# EasyEDA Pro project Universal Transceiver.epro

# Schematic Schematic
Board Name: Universal Receiver; Create Date: 2025-03-07; Page Name: Schematic; Project Name: Universal Receiver; Schematic Name: Schematic; Update Date: 2025-03-12; Add into BOM: yes; Company: MUS; Convert to PCB: yes; Date: 2025-03-07; REV: 1.0; Sheet: 1/1
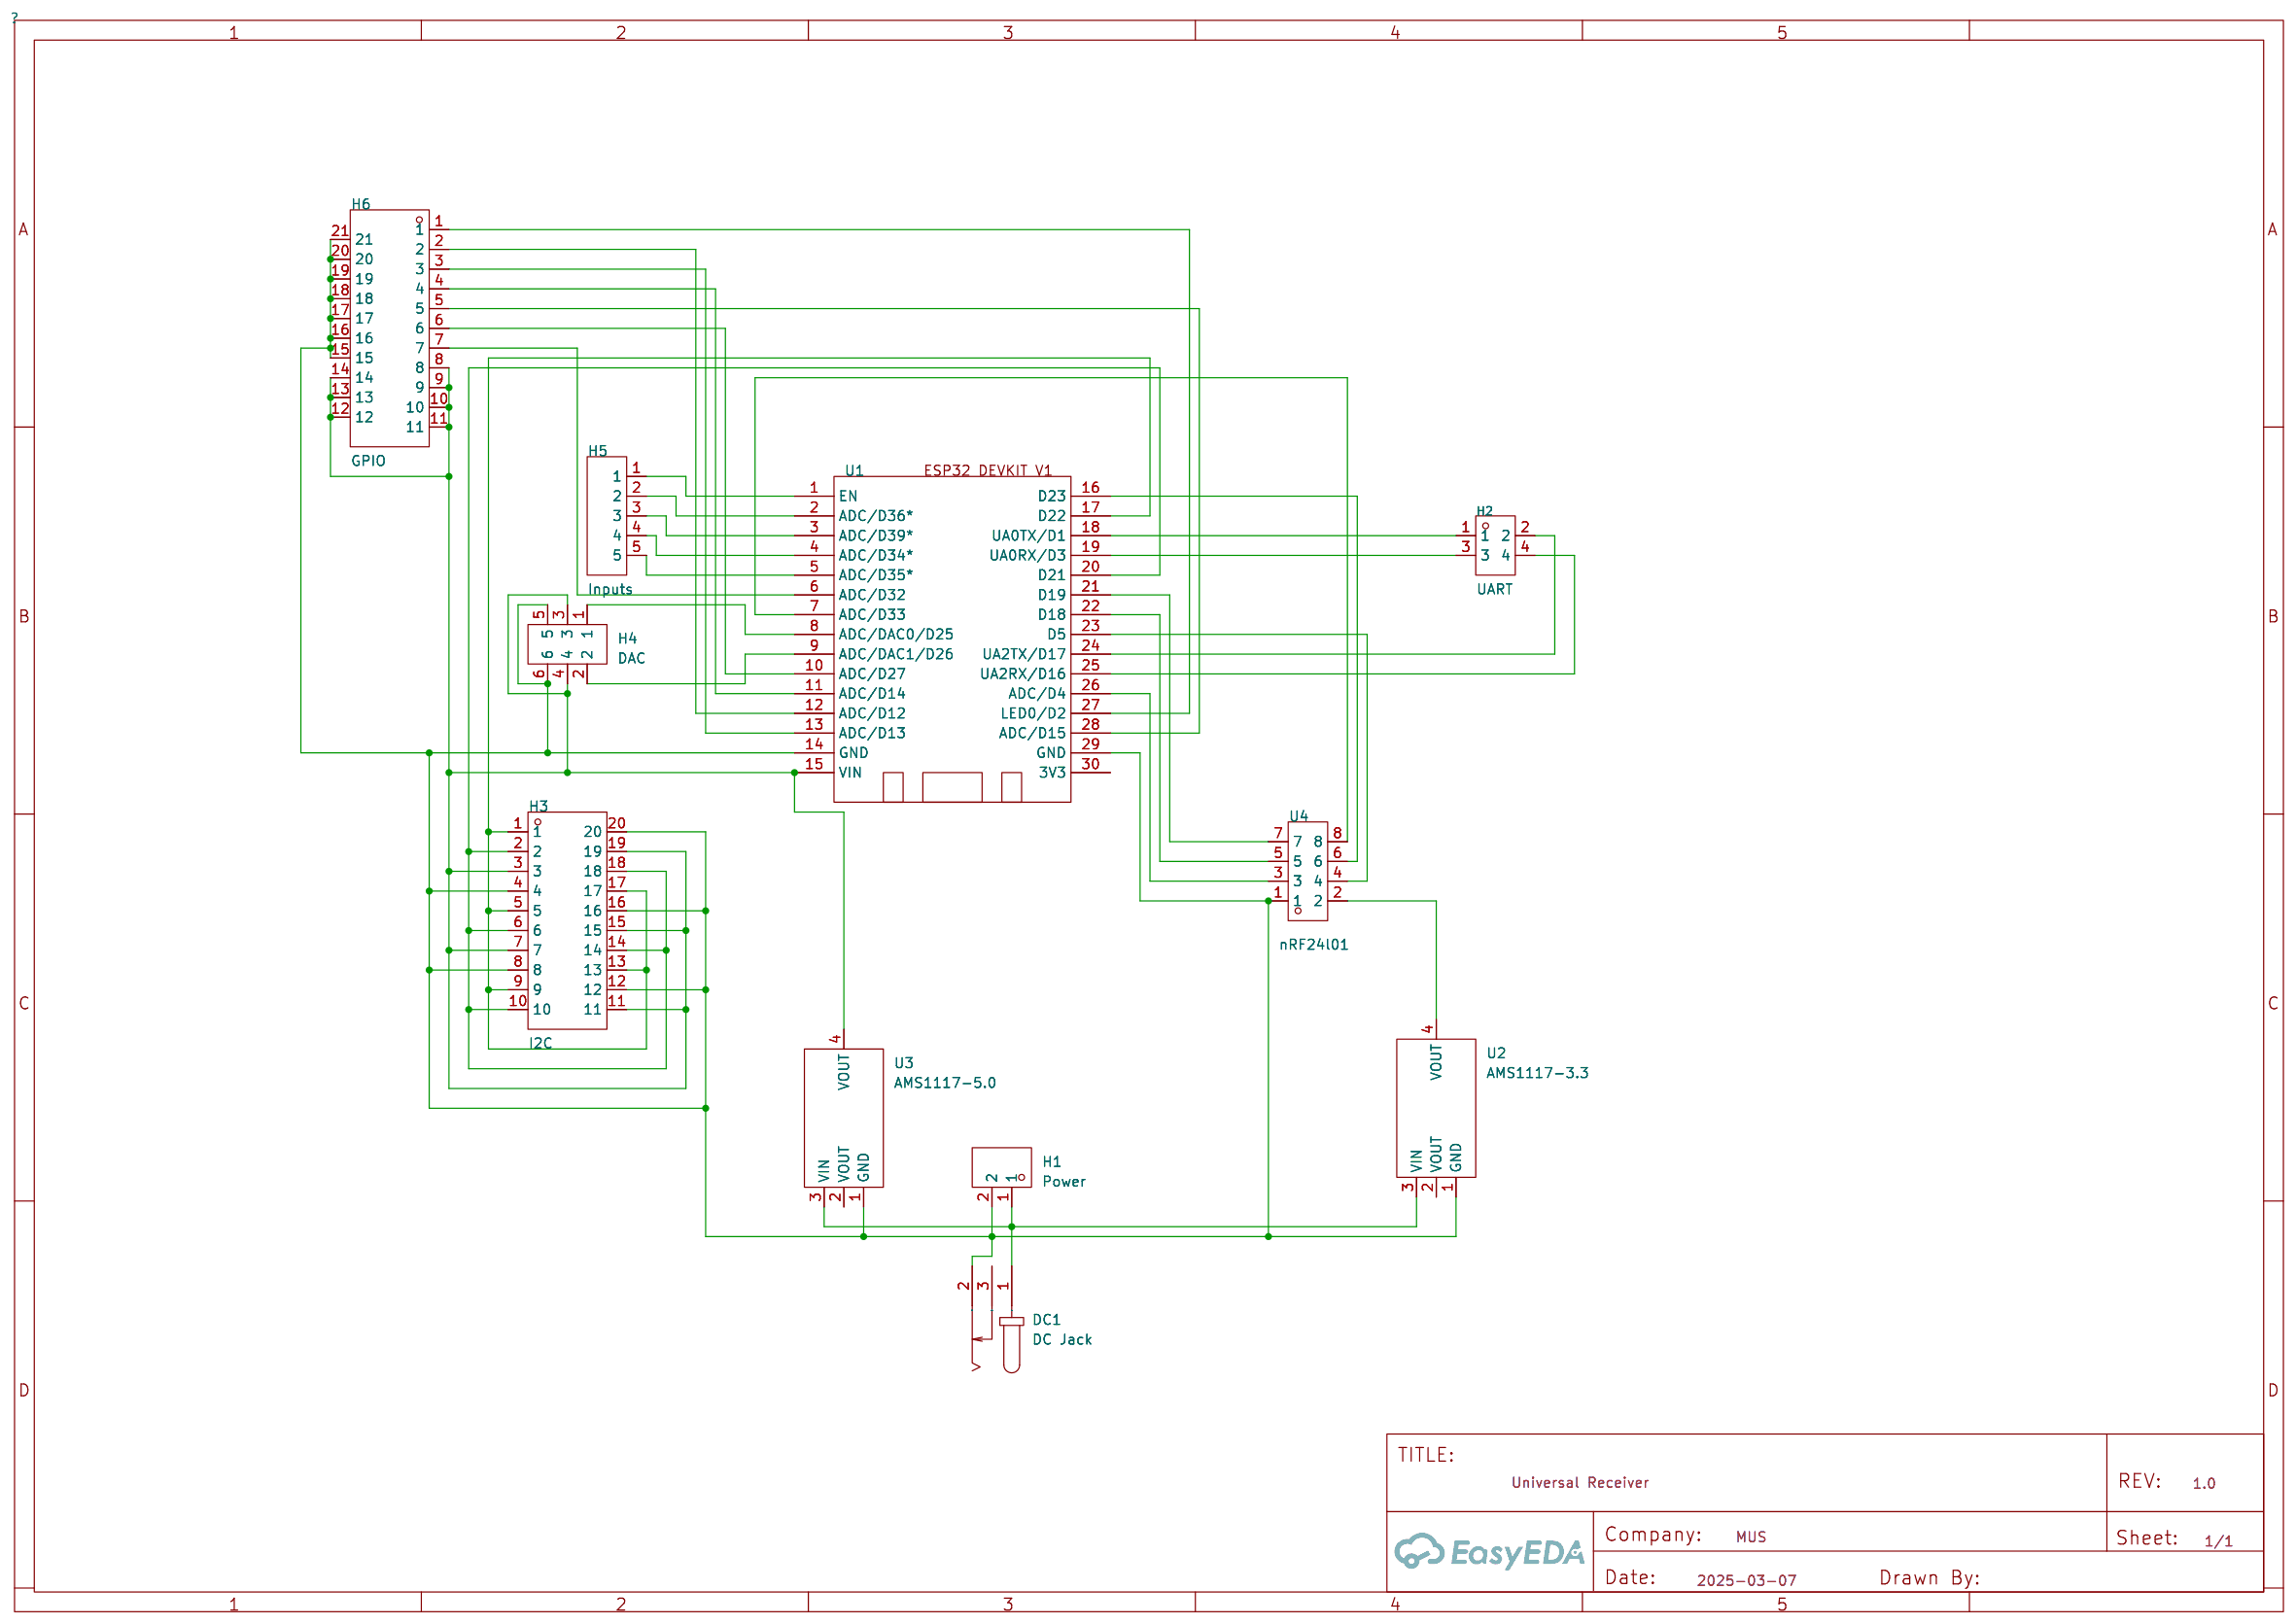
[diagram p0: schematic sheet]

## Parts
DC1  DC Jack  [DC-IN-TH_DC-005-5A-2.0]
H1  Power  [HDR-TH_2P-P2.54-V-M_5]
H2  UART  [HDR-TH_4P-P2.54-V-M-R2-C2-S2.54]
H3  I2C  [HDR-TH_20P-P2.54-V-M-R4-C5-S2.54]
H4  DAC  [HDR-TH_6P-P2.54-V-M-R2-C3-S2.54]
H5  Inputs  [HDR-TH_5P-P2.54-V-M]
H6  GPIO  [CONN-TH_HX-PZ2.54-3X7P-ZZ]
U1  -  [ESP32 Devkit V1]
U2  AMS1117-3.3  [SOT-223-3_L6.5-W3.4-P2.30-LS7.0-BR]
U3  AMS1117-5.0  [SOT-223_L6.5-W3.5-P2.30-LS7.0-BR]
U4  nRF24l01  [HDR-TH_8P-P2.54-V-F-R2-C4-S2.54]

## Library data of the parts
DC1 = DC-005-5A-2.0: Connector Type:DC Power Receptacle Mounting Style:Bend insert Inside Contact Diameter:2mm Outside Contact Diameter:6.2mm Current Rating (Max):5A Voltage Rating (Max):24V Operating Temperature Range:-20℃~+70℃ Operating Temperature Range:-20℃~+70℃; LCSC Part Name: DC电源插座 内径:2mm 外径:6.2mm; Supplier Part: C381116; Manufacturer: XKB Connection(中国星坤); Supplier Footprint: 插件; JLCPCB Part Class: Extended Part; Datasheet: https://atta.szlcsc.com/upload/public/pdf/source/20211015/707A35F7AB6E89C57AAB641950105BB7.pdf; Supplier: LCSC; Connector Type: DC Power Receptacle; Mounting Style: Bend insert; Inside Contact Diameter: 2mm; Outside Contact Diameter: 6.2mm; Current Rating (Max): 5A; Voltage Rating (Max): 24V; Operating Temperature Range: -20℃~+70℃
H1 = PZ254-1-02-Z-C: Pin Structure:1x2P Pitch:2.54mm Row Spacing:- Circluar Pins/Square Pins:Circular Pins Mounting Type:Straight Number of Rows:Plugin Number of Pins:2P Current Rating (Max):3A Length of Mating Pin:4.13mm Insulation Height:3mm Length of End Connection Pin:3mm; LCSC Part Name: 1x2P 间距:2.54mm 圆针 直插; Supplier Part: C5156429; Manufacturer: HCTL(华灿天禄); Supplier Footprint: 插件,P=2.54mm; JLCPCB Part Class: Extended Part; Datasheet: https://atta.szlcsc.com/upload/public/pdf/source/20230609/791AB95BE9F63E00E86E05F9E750B3EF.pdf; Supplier: LCSC; Pin Structure: 1x2P; Pitch: 2.54mm; Circluar Pins/Square Pins: Circular Pins; Mounting Type: Straight; Number of Rows: Plugin; Number of Pins: 2P; Current Rating (Max): 3A; Length of Mating Pin: 4.13mm; Insulation Height: 3mm; Length of End Connection Pin: 3mm; Contact Plating: Gold; Operating Temperature Range: -40℃~+105℃; Soldering Temperature(Max): 260℃@10S; Color: Black
H2 = PZ254-2-02-Z-2.5-G1: Pin Structure:2x2P Pitch:2.54mm Row Spacing:2.54mm Circluar Pins/Square Pins:Square Pins Mounting Type:Straight Number of Rows:双排 Number of Pins:4P Current Rating (Max):3A Length of Mating Pin:6mm Insulation Height:2.5mm Length of End Connection Pin:3mm C; LCSC Part Name: 2x2P 间距:2.54mm 方针 直插; Supplier Part: C18197997; Manufacturer: HCTL(华灿天禄); Supplier Footprint: 插件,P=2.54mm; JLCPCB Part Class: Extended Part; Datasheet: https://atta.szlcsc.com/upload/public/pdf/source/20230921/D8C53D635FAFF8233B09D1367D616037.pdf; Supplier: LCSC; Pin Structure: 2x2P; Pitch: 2.54mm; Row Spacing: 2.54mm; Circluar Pins/Square Pins: Square Pins; Mounting Type: Straight; Number of Rows: 双排; Number of Pins: 4P; Current Rating (Max): 3A; Length of Mating Pin: 6mm; Insulation Height: 2.5mm; Length of End Connection Pin: 3mm; Operating Temperature Range: -40℃~+105℃; Soldering Temperature(Max): 260℃@10S; Color: Black
H3 = HX PZ2.54-4x5P ZZ: Pin Structure:4x5P Pitch:2.54mm Row Spacing:2.54mm Circluar Pins/Square Pins:Policy Mounting Type:Direct Insert Number of Rows:Four rows Number of Pins:20P Current Rating (Max):3A Voltage Rating (Max):- Length of Mating Pin:6mm Insulation Height:2.5mm Len; LCSC Part Name: 4x5P 间距:2.54mm 方针 直插; Supplier Part: C32713299; Manufacturer: hanxia(韩下); Supplier Footprint: 插件,P=2.54mm; JLCPCB Part Class: Extended Part; Datasheet: https://atta.szlcsc.com/upload/public/pdf/source/20240723/6A176166D1A76A78CC2FA8FC287512BB.pdf; Supplier: LCSC; Pin Structure: 4x5P; Pitch: 2.54mm; Row Spacing: 2.54mm; Circluar Pins/Square Pins: Policy; Mounting Type: Direct Insert; Number of Rows: Four rows; Number of Pins: 20P; Current Rating (Max): 3A; Length of Mating Pin: 6mm; Insulation Height: 2.5mm; Length of End Connection Pin: 3mm; Contact Material: Brass; Contact Plating: Gold; Operating Temperature Range: -40℃~+105℃; Color: Black
H4 = DS1021-2x3SF11-B: Pin Structure:2x3P Pitch:2.54mm Mounting Type:Straight Number of Rows:Double Row Number of Pins:6P; LCSC Part Name: 2x3P 间距:2.54mm 直插; Supplier Part: C7430399; Manufacturer: CONNFLY; Supplier Footprint: 插件,P=2.54mm; JLCPCB Part Class: Extended Part; Datasheet: https://atta.szlcsc.com/upload/public/pdf/source/20241114/CDE0584BC14A5BF7A4A12431B1315AA3.pdf; Supplier: LCSC; Pin Structure: 2x3P; Pitch: 2.54mm; Mounting Type: Straight; Number of Rows: Double Row; Number of Pins: 6P
H5 = PZ254V-11-05P: Pin Structure:1x5P Pitch:2.54mm Row Spacing:- Circluar Pins/Square Pins:Policy Mounting Type:Straight Number of Rows:Single Row Number of Pins:5P Current Rating:- Voltage Rating (Max):- Length of Mating Pin:6mm Insulation Height:2.5mm Length of End Connec; LCSC Part Name: 1x5P 间距:2.54mm 方针 直插; Supplier Part: C492404; Manufacturer: XFCN(兴飞); Supplier Footprint: 插件,P=2.54mm; JLCPCB Part Class: Extended Part; Datasheet: https://atta.szlcsc.com/upload/public/pdf/source/20200309/C492404_E51533260F8710EFF5D4617281164C1D.pdf; Supplier: LCSC; Pin Structure: 1x5P; Pitch: 2.54mm; Circluar Pins/Square Pins: Policy; Mounting Type: Straight; Number of Rows: Single Row; Number of Pins: 5P; Length of Mating Pin: 6mm; Insulation Height: 2.5mm; Length of End Connection Pin: 3mm; Contact Material: Brass; Operating Temperature: -40℃~+105℃; Color: Black
H6 = HX PZ2.54-3x7P ZZ: Pin Structure:3x7P Pitch:2.54mm Row Spacing:2.54mm Circluar Pins/Square Pins:Policy Mounting Type:Straight Number of Rows:Triple row Number of Pins:21P Current Rating:3A Voltage Rating (Max):- Length of Mating Pin:6mm Insulation Height:2.5mm Length of End; LCSC Part Name: 3x7P 间距:2.54mm 方针 直插; Supplier Part: C32713294; Manufacturer: hanxia(韩下); Supplier Footprint: 插件,P=2.54mm; JLCPCB Part Class: Extended Part; Datasheet: https://atta.szlcsc.com/upload/public/pdf/source/20240723/0865035114635720ADAE8B7B33218890.pdf; Supplier: LCSC; Pin Structure: 3x7P; Pitch: 2.54mm; Row Spacing: 2.54mm; Circluar Pins/Square Pins: Policy; Mounting Type: Straight; Number of Rows: Triple row; Number of Pins: 21P; Current Rating: 3A; Length of Mating Pin: 6mm; Insulation Height: 2.5mm; Length of End Connection Pin: 3mm; Contact Material: Brass; Contact Plating: Gold; Operating Temperature: -40℃~+105℃; Color: Black
U1 = ESP32 Devkit V1
U2 = AMS1117-3.3_C6186: Output Type:Fixed Voltage - Supply:- Output Voltage:3.3V Output Voltage:3.3V Output Current:1A Power Supply Rejection Ratio (PSRR):72dB@(120Hz) Voltage Dropout:1.3V@(800mA) standby current:- Noise:- Features:Overcurrent Protection(OCP)；Thermal Protection(; LCSC Part Name: 输出3.3V 1A; Supplier Part: C6186; Manufacturer: AMS; Supplier Footprint: SOT-223; JLCPCB Part Class: Basic Part; Datasheet: https://atta.szlcsc.com/upload/public/pdf/source/20180727/C6186_7A095716F0823C02F1997A905E26C086.pdf; Supplier: LCSC; Output Type: Fixed; Output Voltage: 3.3V; Output Current: 1A; Power Supply Rejection Ratio (PSRR): 72dB@(120Hz); Voltage Dropout: 1.3V@(800mA); Features: Overcurrent Protection(OCP)；Thermal Protection(TSD); Output Configuration: Positive electrode; Number of Outputs: 1
U3 = AMS1117-5.0_C6187: Output Type:Fixed Voltage - Supply:12V Output Voltage:5V Output Voltage:5V Output Current:1A Power Supply Rejection Ratio (PSRR):- Voltage Dropout:1.3V@(1A) standby current:- Noise:- Features:Overcurrent Protection(OCP) Operating Temperature:- Operating T; LCSC Part Name: 输入12V 输出5V 1A; Supplier Part: C6187; Manufacturer: AMS; Supplier Footprint: SOT-223; JLCPCB Part Class: Basic Part; Datasheet: https://atta.szlcsc.com/upload/public/pdf/source/20230918/E4B716057EE82179D88E8A0894830D59.pdf; Supplier: LCSC; Output Type: Fixed; Voltage - Supply: 12V; Output Voltage: 5V; Output Current: 1A; Voltage Dropout: 1.3V@(1A); Features: Overcurrent Protection(OCP); Output Configuration: Positive electrode; Number of Outputs: 1
U4 = 2.54-2*4: Holes Structure:2x4P Pitch:2.54mm Row Spacing:2.54mm Circular Hole / Square Hole:Square Holes Mounting Type:Straight Number of Rows:双排 Number of Holes:8P Current Rating (Max):2.5A Voltage Rating (Max):- Holes Direction:Top Insulation Height:8.5mm Operatin; LCSC Part Name: 间距:2.54mm 2x4P 直插; Supplier Part: C2977588; Manufacturer: ZHOURI(洲日); Supplier Footprint: 插件,P=2.54mm; JLCPCB Part Class: Extended Part; Datasheet: https://atta.szlcsc.com/upload/public/pdf/source/20220328/363EB391BC0EB759CF231FC910753CBE.pdf; Supplier: LCSC; Holes Structure: 2x4P; Pitch: 2.54mm; Row Spacing: 2.54mm; Circular Hole / Square Hole: Square Holes; Mounting Type: Straight; Number of Rows: 双排; Number of Holes: 8P; Current Rating (Max): 2.5A; Holes Direction: Top; Insulation Height: 8.5mm; Operating Temperature Range: -40℃~+105℃

## Nets
$1N346: DC1.1 H1.1 U2.3(VIN) U3.3(VIN)
$1N934: U2.4(VOUT) U4.2
Net-(DC1-2): DC1.2 H1.2 H3.4 H3.8 H3.12 H3.16 H3.20 H4.5 H4.6 H6.15 H6.16 H6.17 H6.18 H6.19 H6.20 H6.21 U1.14(GND) U1.29(GND) U2.1(GND) U3.1(GND) U4.1
Net-(H2-1): H2.1 U1.18(UA0TX/D1)
Net-(H2-2): H2.2 U1.24(UA2TX/D17)
Net-(H2-3): H2.3 U1.19(UA0RX/D3)
Net-(H2-4): H2.4 U1.25(UA2RX/D16)
Net-(H3-1): H3.1 H3.5 H3.9 H3.13 H3.17 U1.17(D22)
Net-(H3-2): H3.2 H3.6 H3.10 H3.14 H3.18 U1.20(D21)
Net-(H3-3): H3.3 H3.7 H3.11 H3.15 H3.19 H4.3 H4.4 H6.8 H6.9 H6.10 H6.11 H6.12 H6.13 H6.14 U1.15(VIN) U3.4(VOUT)
Net-(H4-1): H4.1 U1.8(ADC/DAC0/D25)
Net-(H4-2): H4.2 U1.9(ADC/DAC1/D26)
Net-(H5-1): H5.1 U1.1(EN)
Net-(H5-2): H5.2 U1.2(ADC/D36*)
Net-(H5-3): H5.3 U1.3(ADC/D39*)
Net-(H5-4): H5.4 U1.4(ADC/D34*)
Net-(H5-5): H5.5 U1.5(ADC/D35*)
Net-(H6-1): H6.1 U1.27(LED0/D2)
Net-(H6-2): H6.2 U1.12(ADC/D12)
Net-(H6-3): H6.3 U1.13(ADC/D13)
Net-(H6-4): H6.4 U1.11(ADC/D14)
Net-(H6-5): H6.5 U1.28(ADC/D15)
Net-(H6-6): H6.6 U1.10(ADC/D27)
Net-(H6-7): H6.7 U1.6(ADC/D32)
Net-(U1-7): U1.7(ADC/D33) U4.8
Net-(U1-16): U1.16(D23) U4.6
Net-(U1-21): U1.21(D19) U4.7
Net-(U1-22): U1.22(D18) U4.5
Net-(U1-23): U1.23(D5) U4.4
Net-(U1-26): U1.26(ADC/D4) U4.3

Not connected (* = marked no-connect by the designer): DC1 3; U1 30(3V3); U2 2(VOUT); U3 2(VOUT)

# Board PCB
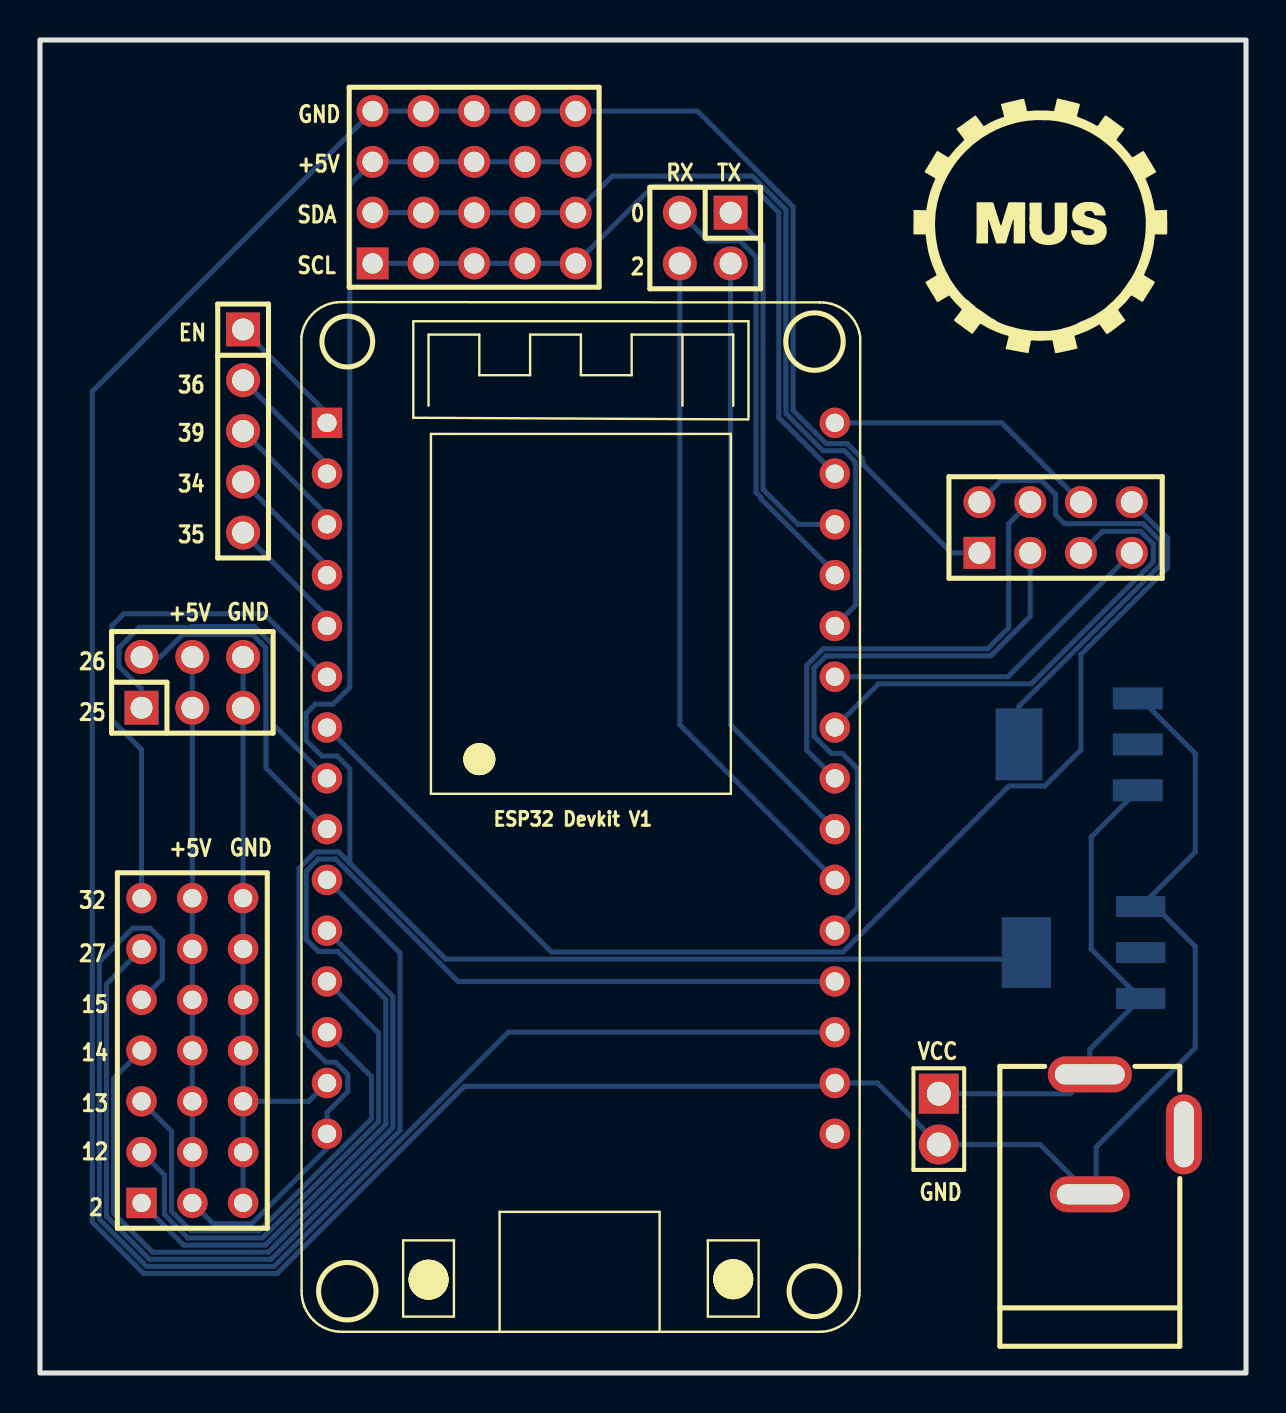
[diagram p1: board, top side]
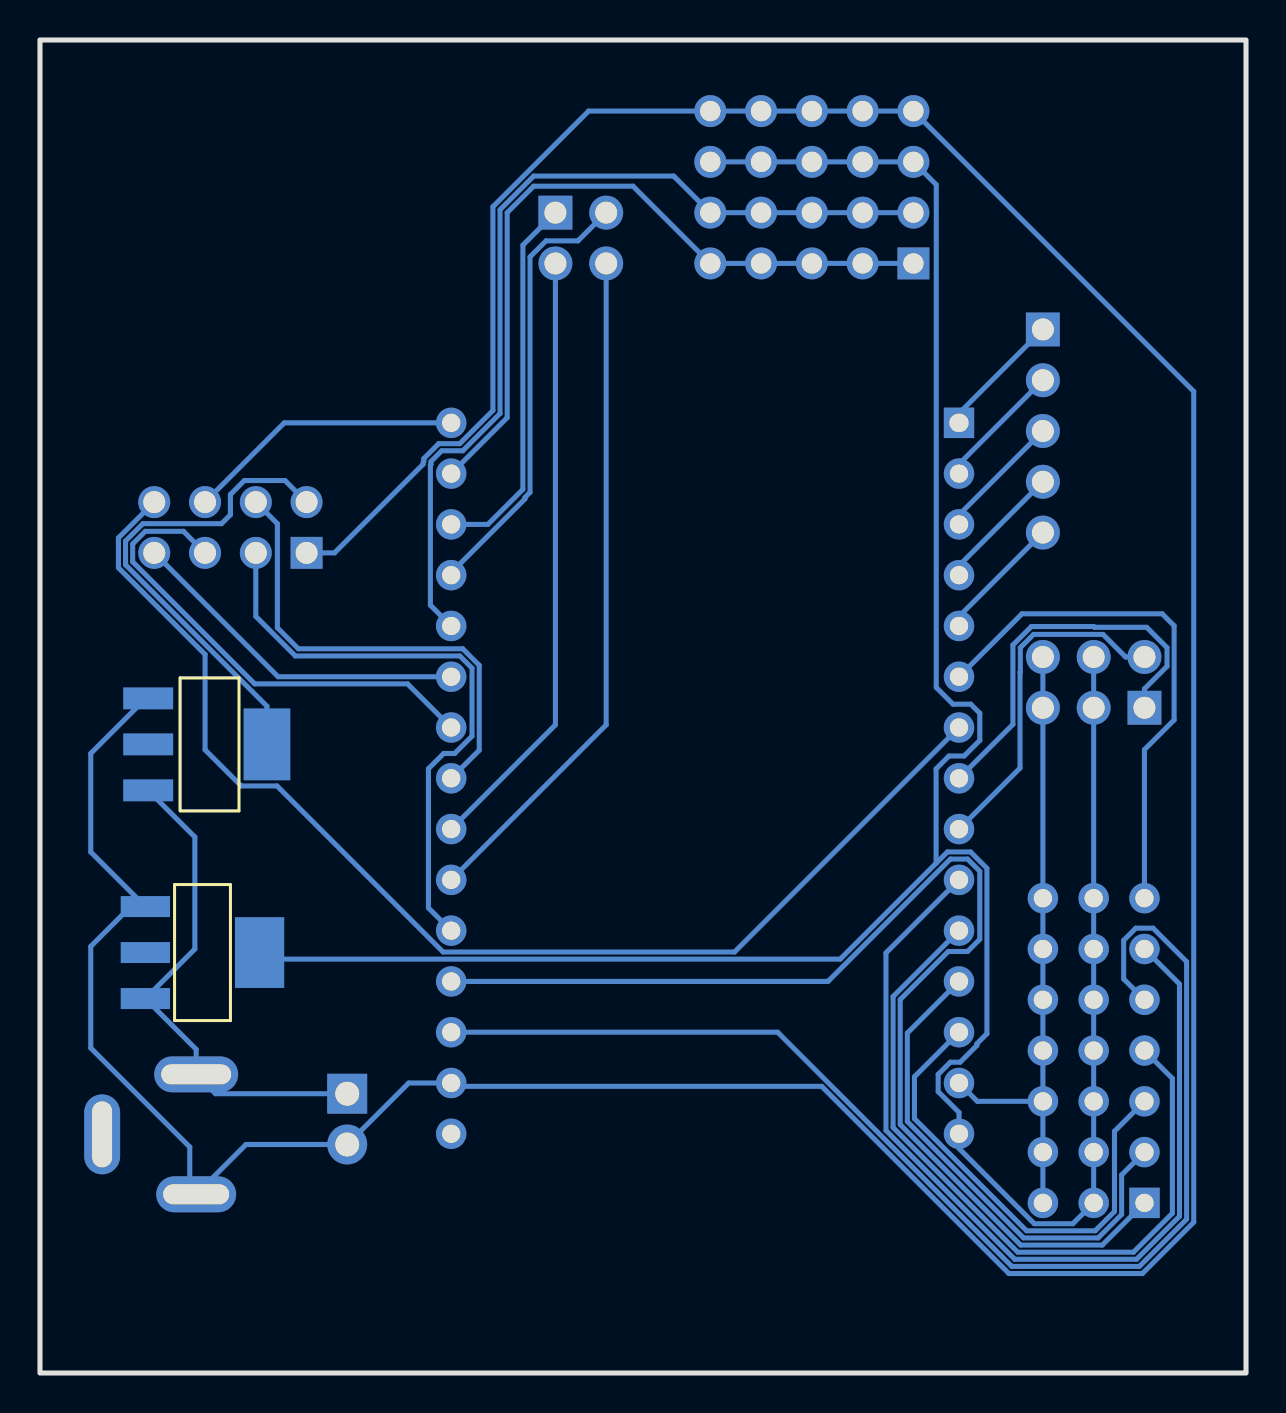
[diagram p2: board, bottom side, seen from below]

Outline 60.32 x 66.67 mm; copper layers: Top Layer, Bottom Layer. Coordinates in mm from the lower left corner of the outline.
Outline path: rectangle 0,66.67 60.32,0
Stack: Top Layer 0.035mm / Dielectric1 1.51mm FR4 er 4.5 / Bottom Layer 0.035mm

## Design rules (mm)
template: JLCPCB Capability(Two Layers Board)
spacing copperThickness1oz (default): track to track 0.102, other pairs 0.152 to 0.3
spacing copperThickness2oz: track to track 0.203, other pairs 0.152 to 0.3
track width copperThickness1oz (default): min 0.127, default 0.254, max 2.54
track width copperThickness2oz: min 0.203, default 0.254, max 2.54
differential pair differentialPair (default): width min 0.127, default 0.254, max 2.54; gap min 0.152, default 0.152
via viaSize (default): diameter min 0.5, default 0.61, max 10; hole min 0.3, default 0.305, max 6.3

## Placement (name value [footprint] x y rotation side)
DC1  DC Jack  [DC-IN-TH_DC-005-5A-2.0]  54.86 11.94 90 top
ESP32 Devkit V1  -  [ESP32 Devkit V1]  27.05 27.81 0 top
H1  Power  [HDR-TH_2P-P2.54-V-M_5]  44.96 12.7 270 top
H2  UART  [HDR-TH_4P-P2.54-V-M-R2-C2-S2.54]  33.27 56.77 180 top
H3  I2C  [HDR-TH_20P-P2.54-V-M-R4-C5-S2.54]  21.72 59.31 0 top
H4  DAC  [HDR-TH_6P-P2.54-V-M-R2-C3-S2.54]  7.62 34.54 0 top
H5  Inputs  [HDR-TH_5P-P2.54-V-M]  10.16 47.12 270 top
H6  GPIO  [CONN-TH_HX-PZ2.54-3X7P-ZZ]  7.62 16.13 90 top
U2  AMS1117-3.3  [SOT-223-3_L6.5-W3.4-P2.30-LS7.0-BR]  51.94 31.44 0 bottom
U3  AMS1117-5.0  [SOT-223_L6.5-W3.5-P2.30-LS7.0-BR]  52.2 21.03 0 bottom
U4  nRF24l01  [HDR-TH_8P-P2.54-V-F-R2-C4-S2.54]  50.8 42.29 0 top

## Footprints (pads in the part's own frame, mm; a bottom-side part is the same pattern mirrored in y, then rotated)
CONN-TH_HX-PZ2.54-3X7P-ZZ
  rect 1.524x1.524 hole 0.914: 1(-7.62,2.54)
  round 1.524 hole 0.914: 2(-5.08,2.54) 3(-2.54,2.54) 4(0,2.54) 5(2.54,2.54) 6(5.08,2.54) 7(7.62,2.54) 8(-7.62,0) 9(-5.08,0) 10(-2.54,0) 11(0,0) 12(2.54,0) 13(5.08,0) 14(7.62,0) 15(-7.62,-2.54) 16(-5.08,-2.54) 17(-2.54,-2.54) 18(0,-2.54) 19(2.54,-2.54) 20(5.08,-2.54) 21(7.62,-2.54)
DC-IN-TH_DC-005-5A-2.0
  oval 1.8x4.2 hole 1x3.5: 1(3,2.352)
  oval 1.8x4 hole 1x3.3: 2(-3,2.352)
  oval 4x1.8 hole 3.3x1: 3(-0.001,-2.352)
ESP32 Devkit V1
  rect 1.524x1.524 hole 0.96x0.914: 1(-12.694,19.713)
  round 1.524 hole 0.914: 2(-12.694,17.173) 3(-12.694,14.633) 4(-12.694,12.093) 5(-12.694,9.553) 6(-12.694,7.013) 7(-12.694,4.473) 8(-12.694,1.933) 9(-12.694,-0.607) 10(-12.694,-3.147) 11(-12.694,-5.687) 12(-12.694,-8.227) 13(-12.694,-10.767) 14(-12.694,-13.307) 15(-12.694,-15.847) 16(12.706,19.713) 17(12.706,17.173) 18(12.706,14.633) 19(12.706,12.093) 20(12.706,9.553) 21(12.706,7.013) 22(12.706,4.473) 23(12.706,1.933) 24(12.706,-0.607) 25(12.706,-3.147) 26(12.706,-5.687) 27(12.706,-8.227) 28(12.706,-10.767) 29(12.706,-13.307) 30(12.706,-15.847)
HDR-TH_2P-P2.54-V-M_5
  rect 2x2 hole 1.2: 1(-1.27,0)
  round 2 hole 1.2: 2(1.27,0)
HDR-TH_4P-P2.54-V-M-R2-C2-S2.54
  rect 1.7x1.7 hole 1.1: 1(-1.27,-1.27)
  round 1.7 hole 1.1: 2(-1.27,1.27) 3(1.27,-1.27) 4(1.27,1.27)
HDR-TH_5P-P2.54-V-M
  rect 1.7x1.7 hole 1.1: 1(-5.08,0)
  round 1.7 hole 1.1: 2(-2.54,0) 3(0,0) 4(2.54,0) 5(5.08,0)
HDR-TH_6P-P2.54-V-M-R2-C3-S2.54
  rect 1.7x1.7 hole 1.1: 1(-2.54,-1.27)
  round 1.7 hole 1.1: 2(-2.54,1.27) 3(0,-1.27) 4(0,1.27) 5(2.54,-1.27) 6(2.54,1.27)
HDR-TH_8P-P2.54-V-F-R2-C4-S2.54
  rect 1.6x1.6 hole 1.1: 1(-3.81,-1.27)
  round 1.6 hole 1.1: 2(-3.81,1.27) 3(-1.27,-1.27) 4(-1.27,1.27) 5(1.27,-1.27) 6(1.27,1.27) 7(3.81,-1.27) 8(3.81,1.27)
HDR-TH_20P-P2.54-V-M-R4-C5-S2.54
  rect 1.6x1.6 hole 1.02: 1(-5.08,-3.81)
  round 1.6 hole 1.02: 2(-5.08,-1.27) 3(-5.08,1.27) 4(-5.08,3.81) 5(-2.54,-3.81) 6(-2.54,-1.27) 7(-2.54,1.27) 8(-2.54,3.81) 9(0,-3.81) 10(0,-1.27) 11(0,1.27) 12(0,3.81) 13(2.54,-3.81) 14(2.54,-1.27) 15(2.54,1.27) 16(2.54,3.81) 17(5.08,-3.81) 18(5.08,-1.27) 19(5.08,1.27) 20(5.08,3.81)
SOT-223-3_L6.5-W3.4-P2.30-LS7.0-BR
  rect 2.5x1.1 smd: 1(2.97,-2.3) 2(2.97,0) 3(2.97,2.3)
  rect 2.34x3.6 smd: 4(-2.97,0)
SOT-223_L6.5-W3.5-P2.30-LS7.0-BR
  rect 2.465x1.05 smd: 1(2.857,-2.3) 2(2.857,0) 3(2.857,2.3)
  rect 2.465x3.54 smd: 4(-2.857,0)

## Nets
$1N346: DC1.1 H1.1 U2.3 U3.3
$1N376: ESP32 Devkit V1.17 H3.1 H3.5 H3.9 H3.13 H3.17
$1N382: ESP32 Devkit V1.20 H3.2 H3.6 H3.10 H3.14 H3.18
$1N389: ESP32 Devkit V1.15 H3.3 H3.7 H3.11 H3.15 H3.19 H4.3 H4.4 H6.8 H6.9 H6.10 H6.11 H6.12 H6.13 H6.14 U3.4
$1N396: DC1.2 ESP32 Devkit V1.14 ESP32 Devkit V1.29 H1.2 H3.4 H3.8 H3.12 H3.16 H3.20 H4.5 H4.6 H6.15 H6.16 H6.17 H6.18 H6.19 H6.20 H6.21 U2.1 U3.1 U4.1
$1N934: U2.4 U4.2
$1N970: ESP32 Devkit V1.26 U4.3
$1N976: ESP32 Devkit V1.22 U4.5
$1N983: ESP32 Devkit V1.21 U4.7
$1N990: ESP32 Devkit V1.7 U4.8
$1N998: ESP32 Devkit V1.16 U4.6
$1N1005: ESP32 Devkit V1.23 U4.4
$1N1349: ESP32 Devkit V1.19 H2.3
$1N1355: ESP32 Devkit V1.18 H2.1
$1N1359: ESP32 Devkit V1.24 H2.2
$1N1366: ESP32 Devkit V1.25 H2.4
$1N1470: ESP32 Devkit V1.8 H4.1
$1N1476: ESP32 Devkit V1.9 H4.2
$1N1730: ESP32 Devkit V1.5 H5.5
$1N1735: ESP32 Devkit V1.4 H5.4
$1N1742: ESP32 Devkit V1.3 H5.3
$1N1749: ESP32 Devkit V1.2 H5.2
$1N1759: ESP32 Devkit V1.1 H5.1
$1N2197: ESP32 Devkit V1.27 H6.1
$1N2203: ESP32 Devkit V1.12 H6.2
$1N2209: ESP32 Devkit V1.13 H6.3
$1N2216: ESP32 Devkit V1.11 H6.4
$1N2223: ESP32 Devkit V1.28 H6.5
$1N2230: ESP32 Devkit V1.10 H6.6
$1N2243: ESP32 Devkit V1.6 H6.7

Pads without a net: DC1 3; ESP32 Devkit V1 30; U2 2; U3 2

## Routing (per net, layer and track width the routed paths; a pad name or vN(x,y) marks a point on that pad's centre or on a via; arc(x,y) is an arc through that point)
$1N346: length 25.2
  Bottom Layer w0.254: H1.1 51.54,13.97 DC1.1 52.51,16.19 U3.3 52.58,21.21 52.58,26.81 U2.3
$1N376: length 36.7
  Bottom Layer w0.254: H3.1 H3.9 H3.13 26.8,55.5 30.66,59.36 35.63,59.36 36.96,58.04 36.96,47.78 ESP32 Devkit V1.17
$1N382: length 45.4
  Bottom Layer w0.254: H3.2 H3.10 H3.14 26.8,58.04 28.63,59.87 35.63,59.87 37.31,58.19 37.31,47.99 39.18,46.13 40.23,46.13 40.77,45.59 40.77,45.45 40.8,45.42 40.8,38.41 ESP32 Devkit V1.20
$1N389: length 139.3
  Bottom Layer w0.254: U3.4 49.01,20.7 20.3,20.7 15.5,25.5 ; H4.4 H4.3 H6.13 H6.11 H6.10 H6.9 H6.8 8.66,7.47 10.59,7.47 14.36,11.23 ESP32 Devkit V1.15 14.36,13.03 15.4,14.07 15.4,14.94 14.79,15.55 14.3,15.55 13.46,16.38 13.46,16.47 12.96,16.97 12.96,25.24 13.78,26.06 14.94,26.06 15.5,25.5 ; 15.5,25.5 15.5,30.22 14.86,30.86 14.1,30.86 13.32,31.64 13.32,33 13.77,33.45 14.66,33.45 15.49,34.29 15.49,59.44 H3.3 H3.11 H3.15 26.8,60.58
$1N396: length 227
  Bottom Layer w0.254: U2.1 55.03,33.74 57.78,30.99 57.78,26.06 U3.1 55.79,23.33 57.78,21.34 57.78,16.26 52.83,11.3 52.83,9.26 DC1.2 50.02,11.43 H1.2 41.88,14.51 ESP32 Devkit V1.29 39.59,14.34 21.22,14.34 11.86,4.98 5.18,4.98 2.61,7.54 2.61,49.1 H3.4 H3.12 H3.16 32.88,63.12 37.67,58.33 37.67,48.14 39.32,46.48 40.38,46.48 41.12,45.74 41.12,45.59 41.15,45.56 41.15,45.46 45.59,41.02 U4.1 ; H6.17 13.44,13.59 ESP32 Devkit V1.14 ; H6.17 H6.18 H6.20 H4.5 H4.6 ; H6.17 H6.16 H6.15
$1N934: length 24.5
  Bottom Layer w0.254: U2.4 48.97,33.35 56.04,40.42 56.04,41.62 55.18,42.48 51.24,42.48 50.8,42.93 50.8,43.94 50.1,44.64 48.07,44.64 U4.2
$1N970: length 29.9
  Bottom Layer w0.254: U4.3 49.53,37.85 47.55,35.87 39.32,35.87 38.72,35.26 38.72,31.85 39.58,30.99 40.13,30.99 40.89,30.23 40.89,23.26 ESP32 Devkit V1.26
$1N976: length 24.6
  Bottom Layer w0.254: ESP32 Devkit V1.22 41.94,34.47 49.58,34.47 55.69,40.57 55.69,41.47 55.06,42.1 53.15,42.1 U4.5
$1N983: length 17.4
  Bottom Layer w0.254: ESP32 Devkit V1.21 48.41,34.83 U4.7
$1N990: length 61.5
  Bottom Layer w0.254: U4.8 56.4,41.77 56.4,40.28 52.07,35.94 52.07,31.17 50.26,29.36 48.47,29.36 40.16,21.06 25.59,21.06 ESP32 Devkit V1.7
$1N998: length 14
  Bottom Layer w0.254: U4.6 48.1,47.53 ESP32 Devkit V1.16
$1N1005: length 23.8
  Bottom Layer w0.254: ESP32 Devkit V1.23 38.35,31.15 38.35,35.4 39.18,36.22 47.4,36.22 48.45,37.28 48.45,42.48 U4.4
$1N1349: length 22.3
  Bottom Layer w0.254: H2.3 33.41,56.63 35.01,56.63 35.81,55.83 35.81,44.05 36.07,43.79 36.07,43.72 39.76,40.03 ESP32 Devkit V1.19
$1N1355: length 18.8
  Bottom Layer w0.254: ESP32 Devkit V1.18 37.92,42.45 36.17,44.2 36.17,56.41 H2.1
$1N1359: length 30.5
  Bottom Layer w0.254: ESP32 Devkit V1.24 34.54,32.42 H2.2
$1N1366: length 34
  Bottom Layer w0.254: H2.4 32,32.42 ESP32 Devkit V1.25
$1N1470: length 19.8
  Bottom Layer w0.254: H4.1 5.08,34.22 3.95,35.35 3.95,36.28 4.97,37.3 7.58,37.3 7.62,37.34 10.74,37.34 11.66,36.42 11.66,32.44 ESP32 Devkit V1.8
$1N1476: length 17.3
  Bottom Layer w0.254: H4.2 6.02,35.81 7.15,36.94 10.63,36.94 11.29,36.28 11.29,35.07 11.3,35.05 11.3,30.26 ESP32 Devkit V1.9
$1N1730: length 6.4
  Bottom Layer w0.254: H5.5 14.36,37.84 ESP32 Devkit V1.5
$1N1735: length 6.4
  Bottom Layer w0.254: H5.4 14.36,40.38 ESP32 Devkit V1.4
$1N1742: length 6.4
  Bottom Layer w0.254: ESP32 Devkit V1.3 14.36,42.92 H5.3
$1N1749: length 6.4
  Bottom Layer w0.254: ESP32 Devkit V1.2 14.36,45.46 10.16,49.66
$1N1759: length 6.4
  Bottom Layer w0.254: H5.1 14.36,48 ESP32 Devkit V1.1
$1N2197: length 59.7
  Bottom Layer w0.254: ESP32 Devkit V1.27 20.91,19.59 14.79,25.71 13.93,25.71 13.32,25.1 13.32,21.69 13.93,21.08 14.89,21.08 17.3,18.68 17.3,12.43 11.27,6.4 7.19,6.4 H6.1
$1N2203: length 25.3
  Bottom Layer w0.254: H6.2 6.22,9.91 6.22,7.93 7.4,6.76 11.12,6.76 16.94,12.58 16.94,17 ESP32 Devkit V1.12
$1N2209: length 24.1
  Bottom Layer w0.254: ESP32 Devkit V1.13 16.59,14.82 16.59,12.72 10.97,7.11 7.55,7.11 6.58,8.08 6.58,12.09 H6.3
$1N2216: length 37.3
  Bottom Layer w0.254: ESP32 Devkit V1.11 17.65,18.83 17.65,12.28 11.42,6.04 5.63,6.04 3.68,7.99 3.68,14.73 H6.4
$1N2223: length 63
  Bottom Layer w0.254: 5.08,18.67 6.12,19.71 6.12,21.64 5.51,22.25 4.65,22.25 2.97,20.57 2.97,7.69 5.33,5.33 11.71,5.33 23.43,17.05 ESP32 Devkit V1.28
$1N2230: length 46.4
  Bottom Layer w0.254: ESP32 Devkit V1.10 18.01,21.01 18.01,12.13 11.56,5.69 5.48,5.69 3.33,7.84 3.33,19.46 H6.6
$1N2243: length 26.6
  Bottom Layer w0.254: 5.08,23.75 5.08,31.18 3.59,32.66 3.59,37.38 4.19,37.97 11.21,37.97 ESP32 Devkit V1.6

## Text on the board
Top Silkscreen Layer: 26 | 25 | 32 | 27 | 15 | 14 | 13 | 12 | 2 | +5V | 36 | 39 | 34 | 35 | GND | SDA | SCL | 0 | RX | TX | VCC | EN
